# Altium project Board4_Sensor_Pcb.PrjPcb
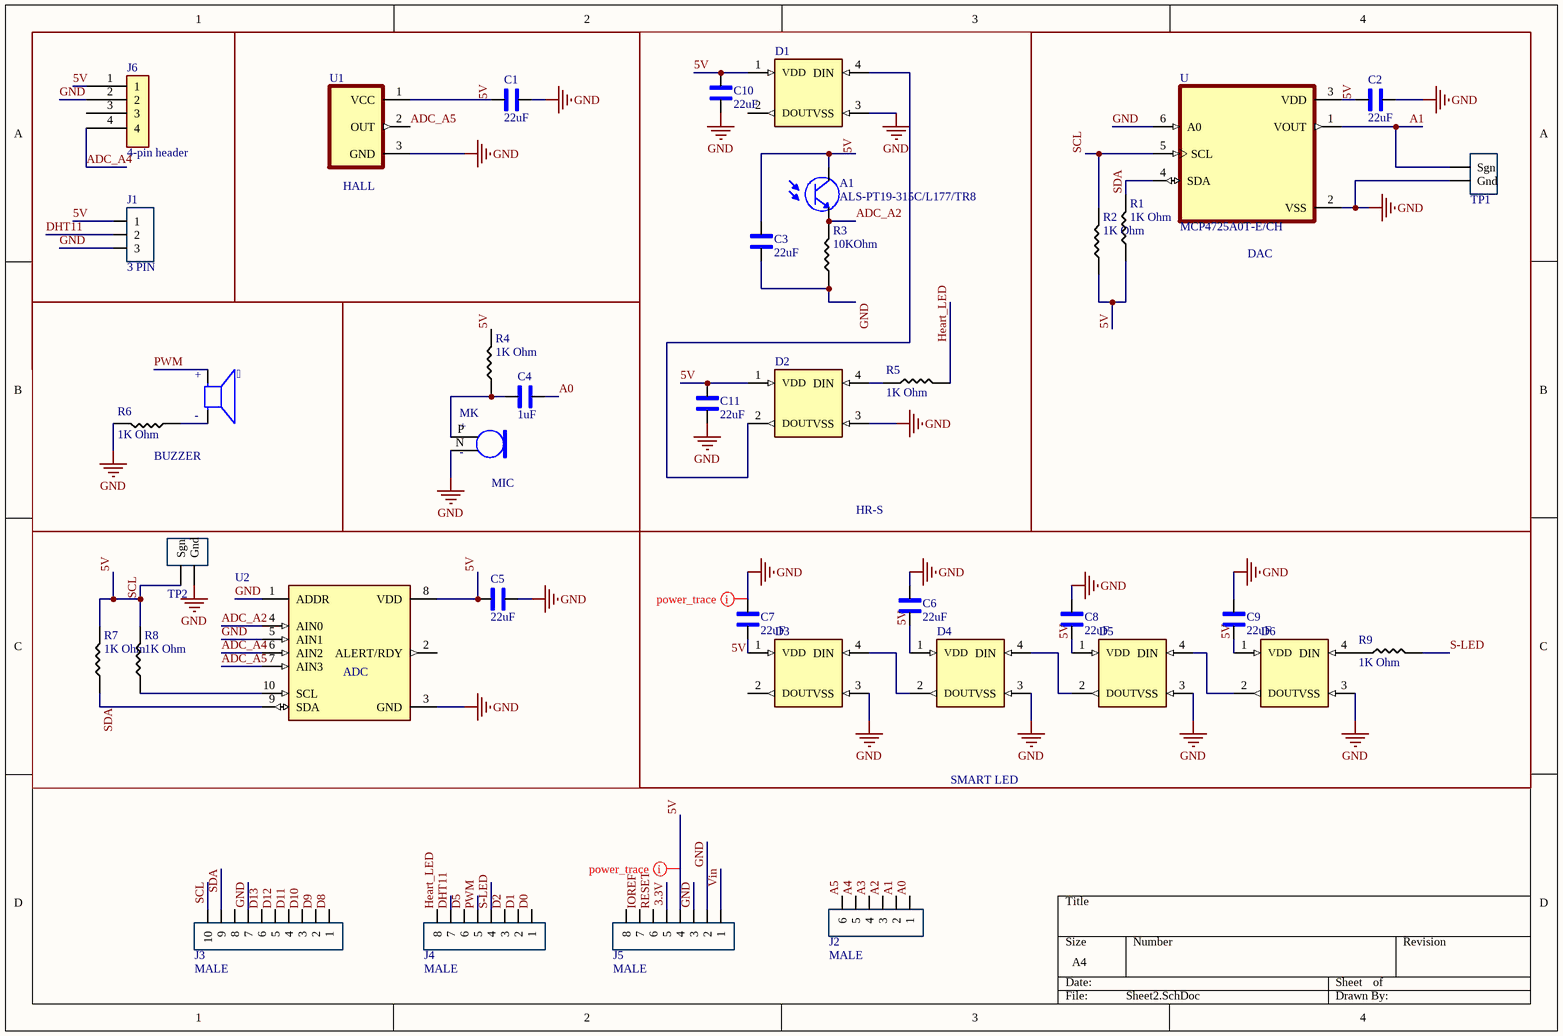
[diagram p0: Sheet2.SchDoc]
1 sheet, 40 parts. Net scope: global (net labels, ports and power ports of the same name join across sheets).

## Sheet Sheet2.SchDoc
size A4; SheetNumber: 1; SheetTotal: 1

### Parts
  AT-1224-TWT-5V-2-R  [XDCR_AT-1224-TWT-5V-2-R]  (value not drawn)
A1  ALS-PT19-315C/L177/TR8  [XDCR_ALS-PT19-315C/L177/TR8]
C1  22uF  [1206_Passive_Capacitor]
C2  22uF  [1206_Passive_Capacitor]
C3  22uF  [1206_Passive_Capacitor]
C4  1uF  [1206_Passive_Capacitor]
C5  22uF  [1206_Passive_Capacitor]
C6  22uF  [1206_Passive_Capacitor]
C7  22uF  [1206_Passive_Capacitor]
C8  22uF  [1206_Passive_Capacitor]
C9  22uF  [1206_Passive_Capacitor]
C10  22uF  [1206_Passive_Capacitor]
C11  22uF  [1206_Passive_Capacitor]
D1  IN-PI55QATPRPGPBPW  [SERIAL_LED]  (value not drawn)
D2  IN-PI55QATPRPGPBPW  [SERIAL_LED]  (value not drawn)
D3  IN-PI55QATPRPGPBPW  [SERIAL_LED]  (value not drawn)
D4  IN-PI55QATPRPGPBPW  [SERIAL_LED]  (value not drawn)
D5  IN-PI55QATPRPGPBPW  [SERIAL_LED]  (value not drawn)
D6  IN-PI55QATPRPGPBPW  [SERIAL_LED]  (value not drawn)
J1  3 PIN  [3_PIN_100mil]
J2  MALE  [6_PIN_100MIL]
J3  value MALE  [10_PIN_100MIL]  (hidden comment: MALE 10PIN)
J4  value MALE  [8_PIN_100MIL]  (hidden comment: MALE 8PIN)
J5  value MALE  [8_PIN_100MIL]  (hidden comment: MALE 8PIN)
J6  4-pin header  [4pinheader]
MK  CMEJ-0415-42-P  [MIC_CMEJ-0415-42-P]  (value not drawn)
R1  value 1K Ohm  [1206_Passive_Resitor]  (hidden comment: 1k)
R2  value 1K Ohm  [1206_Passive_Resitor]  (hidden comment: 1k)
R3  value 10KOhm  [1206_Passive_Resitor]  (hidden comment: 10k)
R4  value 1K Ohm  [1206_Passive_Resitor]  (hidden comment: 1k)
R5  value 1K Ohm  [1206_Passive_Resitor]  (hidden comment: 1k)
R6  value 1K Ohm  [1206_Passive_Resitor]  (hidden comment: 1k)
R7  value 1K Ohm  [1206_Passive_Resitor]  (hidden comment: 1k)
R8  value 1K Ohm  [1206_Passive_Resitor]  (hidden comment: 1k)
R9  value 1K Ohm  [1206_Passive_Resitor]  (hidden comment: 1k)
TP1  10x Probe TP  [TP10x_Probe]  (value not drawn)
TP2  10x Probe TP  [TP10x_Probe]  (value not drawn)
U  MCP4725A0T-E/CH  [SOT95P270X145-6N]
U1  DRV5053RAQDBZT  [SOT95P237X112-3N]  (value not drawn)
U2  ADS1115IDGSR  [ADC_ADS1115IDGSR]  (value not drawn)

### Blocks framed on the sheet
HALL: C1 U1
HR-S: A1 C3 C10 C11 D1 D2 R3 R5
DAC: C2 R1 R2 TP1 U
BUZZER:  R6
MIC: C4 MK R4
ADC: C5 R7 R8 TP2 U2
SMART LED: C6-C9 D3-D6 R9

### Nets
GND: C1.2 C2.2 C3.1 C5.2 C6.2 C7.2 C8.2 C9.2 C10.1 C11.1 D1.3(VSS) D2.3(VSS) D3.3(VSS) D4.3(VSS) D5.3(VSS) D6.3(VSS) J1.3 J3.7 J5.2 J5.3 J6.2 MK.N(GND) R3.1 R6.2 TP1.2(Gnd) TP2.2(Gnd) U.2(VSS) U.6(A0) U1.3(GND) U2.1(ADDR) U2.3(GND) U2.5(AIN1)
3.3V: J5.5
5V: A1.1(C) C1.1 C2.1 C3.2 C5.1 C6.1 C7.1 C8.1 C9.1 C10.2 C11.2 D1.1(VDD) D2.1(VDD) D3.1(VDD) D4.1(VDD) D5.1(VDD) D6.1(VDD) J1.1 J3.10 J5.4 J6.1 R1.1 R2.1 R2.2 R4.2 R7.2 R8.2 TP2.1(Sgn) U.3(VDD) U.5(SCL) U1.1(VCC) U2.8(VDD)  [also labelled SCL]
A0: C4.2 J2.1
A1: J2.2 TP1.1(Sgn) U.1(VOUT)
A2: J2.3
A3: J2.4
A4: J2.5
A5: J2.6
ADC_A2: A1.2(E) R3.2 U2.4(AIN0)
ADC_A4: J6.4 U2.6(AIN2)
ADC_A5: U1.2(OUT) U2.7(AIN3)
D0: J4.1
D1: J4.2
D2: J4.3
D5: J4.6
D8: J3.1
D9: J3.2
D10: J3.3
D11: J3.4
D12: J3.5
D13: J3.6
DHT11: J1.2 J4.7
Heart_LED: J4.8 R5.2
IOREF: J5.7
PWM: .P J4.5
RESET: J5.6
S-LED: J4.4 R9.2
SDA: J3.9 R1.2 R7.1 U.4(SDA) U2.9(SDA)
Vin: J5.1
Net_N: .N R6.1
NetC4_1: C4.1 MK.P(OUTPUT) R4.1
NetD1_4: D1.4(DIN) D2.2(DOUT)
NetD2_4: D2.4(DIN) R5.1
NetD3_4: D3.4(DIN) D4.2(DOUT)
NetD4_4: D4.4(DIN) D5.2(DOUT)
NetD5_4: D5.4(DIN) D6.2(DOUT)
NetD6_4: D6.4(DIN) R9.1
NetR8_1: R8.1 U2.10(SCL)

Not connected (* = marked no-connect by the designer): D1 2(DOUT); D3 2(DOUT); J3 8; J5 8; J6 3; U2 2(ALERT/RDY)

### Layout directives
rule Width Constraint [Pref Width = 20mil    Min Width = 10mil    Max Width = 100mil]; rule Width Constraint [Pref Width = 20mil    Min Width = 10mil    Max Width = 100mil]; rule Width Constraint [Pref Width = 20mil    Min Width = 10mil    Max Width = 100mil]: 5V, GND

### Notes on the sheet
- (in symbol AT-1224-TWT-5V-2-R) +; -
- (in symbol CMEJ-0415-42-P) +; -

### Library data of the parts
 = AT-1224-TWT-5V-2-R: AUDIO TRANSDUCER 5 VP-P 87 DB 2400 HZ; MF: PUI Audio,; Check_prices: https://www.snapeda.com/parts/AT-1224-TWT-5V-2-R/PUI%20Audio,%20Inc./view-part/453710/?ref=eda; Purchase-URL: https://pricing.snapeda.com/search/part/AT-1224-TWT-5V-2-R/?ref=eda; SnapEDA_Link: https://www.snapeda.com/parts/AT-1224-TWT-5V-2-R/PUI%20Audio,%20Inc./view-part/453710/?ref=snap; Value: *; MP: AT-1224-TWT-5V-2-R; Package: PUI Audio,; Price: None; Availability: In Stock
A1 = ALS-PT19-315C/L177/TR8: Phototransistors 630nm 2-SMD, No Lead; MF: Everlight; Availability: Good; Check_prices: https://www.snapeda.com/parts/ALS-PT19-315C/L177/TR8/Everlight%20Electronics%20Co%20Ltd/view-part/226235/?ref=eda; SnapEDA_Link: https://www.snapeda.com/parts/ALS-PT19-315C/L177/TR8/Everlight%20Electronics%20Co%20Ltd/view-part/226235/?ref=snap; MP: ALS-PT19-315C/L177/TR8; Price: None; Purchase-URL: https://pricing.snapeda.com/search/part/ALS-PT19-315C/L177/TR8/?ref=eda; Package: None; Value: *
C1-C3 C5-C11 = C_22uF_1206: 22uF ±10% 25V X5R 1206 Multilayer Ceramic Capacitors MLCC - SMD/SMT RoHS; MFR Part #: CL31A226KAHNNNE; Type: Extended; LCSC Part#: C12891; Datasheet: https://datasheet.lcsc.com/lcsc/1811031514_Samsung-Electro-Mechanics-CL31A226KAHNNNE_C12891.pdf; Value: 22uF
C4 = C_1uF_1206: MULTILAYER CERAMIC CAPACITORS MLCC - SMD/SMT 1UF 50V 1206 ROHS; MFR Part #: CL31B105KBHNNNE; Type: Basic; Digikey Link: https://www.digikey.com/product-detail/en/C1206C105M4RACTU/399-8150-1-ND/3471873/?itemSeq=304982366; Digikey Part: 399-8150-1-ND; LCSC Part#: C1848; Value: 1uF
D1-D6 = LED_Smart_5050: Digital Series Cascade LED; DigiKey: https://www.digikey.com/product-detail/en/inolux/IN-PI55QATPRPGPBPW-60/1830-1209-1-ND/9681289; Parameter 1: *
J1 = J_3_PIN_HEADER: 3 2.54mm Straight 1 Header，Breakaway Through Hole Pin Header & Female Header ROHS; MFR Part #: C49257; Type: Extended; Datasheet: https://datasheet.lcsc.com/lcsc/1811132313_BOOMELE-Boom-Precision-Elec-C49257_C49257.pdf; LCSC Part#: C49257; Value: 3 PIN
J2 = JF_6_PIN_MALE: Male header- 6 pin 1 row- through Hole; LCSC Part#: C37208; Datasheet: https://datasheet.lcsc.com/szlcsc/1810312320_BOOMELE-Boom-Precision-Elec-C37208_C37208.pdf; Type: Extended; Value: MALE
J3 = JF_10_PIN_MALE: Pin Header 10 1 right-angle，180degrees 2.54mm Through Hole,P=2.54mm Pin Header & Female Header RoHS; LCSC Part#: C124372; Type: Extended; Datasheet: https://datasheet.lcsc.com/szlcsc/1810241611_Ckmtw-Shenzhen-Cankemeng-C124372_C124372.pdf
J4 J5 = JF_8_PIN_MALE: Pin Header 8 1 right-angle，180degrees 2.54mm Through Hole,P=2.54mm Pin Header & Female Header RoHS; LCSC Part#: C492407; Datasheet: https://datasheet.lcsc.com/szlcsc/2003191006_XFCN-PZ254V-11-08P_C492407.pdf; Type: Extended
J6 = J
MK = CMEJ-0415-42-P: 4.0 Ð¼Ð¼, Ð²ÑÐµÐ½Ð°Ð¿Ñ€Ð°Ð²Ð»ÐµÐ½Ð½Ñ‹Ð¹, Ð¼Ð¾Ð½Ñ‚Ð°Ð¶ Ð½Ð° Ð¿ÐµÑ‡Ð°Ñ‚Ð½Ð¾Ð¹ Ð¿Ð»Ð°Ñ‚Ðµ, 2.0 Ð’ Ð¿Ð¾ÑÑ‚Ð¾ÑÐ½Ð½Ð¾Ð³Ð¾ Ñ‚Ð¾ÐºÐ°, Ð­Ð»ÐµÐºÑ€ÐµÑ‚-ÐºÐ¾Ð½Ð´ÐµÐ½ÑÐ°Ñ‚Ð¾Ñ€Ð½Ñ‹Ð¹ Ð¼Ð¸ÐºÑ€Ð¾Ñ„Ð¾Ð½; MF: CUI Devices; Digi-Key_Part_Number: 102-6542-ND; Package: CUI Inc.; CUI_purchase_URL: https://www.cuidevices.com/product/audio/microphones/electret-condenser-microphones/cmej-0415-42-p?utm_source=snapeda.com&utm_medium=referral&utm_campaign=snapedaBOM; MP: CMEJ-0415-42-P; Digi-Key_Purchase_URL: https://www.digikey.com/product-detail/en/cui-devices/CMEJ-0415-42-P/102-6542-ND/10253451?utm_source=snapeda&utm_medium=aggregator&utm_campaign=symbol; SnapEDA_Link: https://www.snapeda.com/parts/CMEJ-0415-42-P/CUI%20Devices/view-part/3625885/?ref=snap; Value: *
R1 R2 R4-R9 = R_1K_1206: CHIP RESISTOR - SURFACE MOUNT 1KOHMS ±1% 1/4W 1206 ROHS; MFR Part #: 1206W4F1001T5; Digikey Link: https://www.digikey.com/product-detail/en/RNCP1206FTD1K00/RNCP1206FTD1K00CT-ND/2240675/?itemSeq=304982373; Digikey Part: RNCP1206FTD1K00CT-ND; LCSC Part#: C4410; Type: Basic
R3 = R_10KOhm_1206: 10 kOhms ±5% 0.25W, 1/4W Chip Resistor 1206 (3216 Metric) Automotive AEC-Q200 Thick Film; Digikey Link: https://www.digikey.com/product-detail/en/RMCF1206JT300R/RMCF1206JT300RCT-ND/1942776/?itemSeq=304982374; Digikey Part: RMCF1206JT300RCT-ND; LCSC Part#: C17902; Type: Basic
TP1 TP2 = TP_10x_Probe: Test Point 300 mil centers
U = MCP4725A0T-E/CH: 12 Bit Digital to Analog Converter 1 SOT-23-6; MF: Microchip; Package: SOT-23-6 Microchip; Value: *; Availability: Unavailable; SnapEDA_Link: https://www.snapeda.com/parts/MCP4725A0T-E/CH/Microchip/view-part/109888/?ref=snap; Price: None; MP: MCP4725A0T-E/CH
U1 = DRV5053RAQDBZT: SENSOR LINEAR ANALOG SOT23-3; Package: None; Price: None; Value: *; MP: DRV5053RAQDBZT; Availability: Unavailable
U2 = U_ADC_ADS1115IDGSR: 16-Bit ADC with Integrated MUX, PGA, Comparator, Oscillator, and Reference 10-VSSOP -40 to 125; MFR Part #: ADS1115IDGSR; Package: MSOP-10 Texas Instruments; LCSC Part#: C37593; SnapEDA_Link: https://www.snapeda.com/parts/ADS1115IDGSR/Texas%20Instruments/view-part/?ref=snap; Type: Extended; Digi-Key_Purchase_URL: https://www.digikey.com/product-detail/en/texas-instruments/ADS1115IDGSR/296-38849-1-ND/5142969?utm_source=snapeda&utm_medium=aggregator&utm_campaign=symbol; Value: *